# Altium project DC2019_Main_PCB.PrjPCB (part 2 of 2)

## Sheet Row Drivers.SchDoc
size B
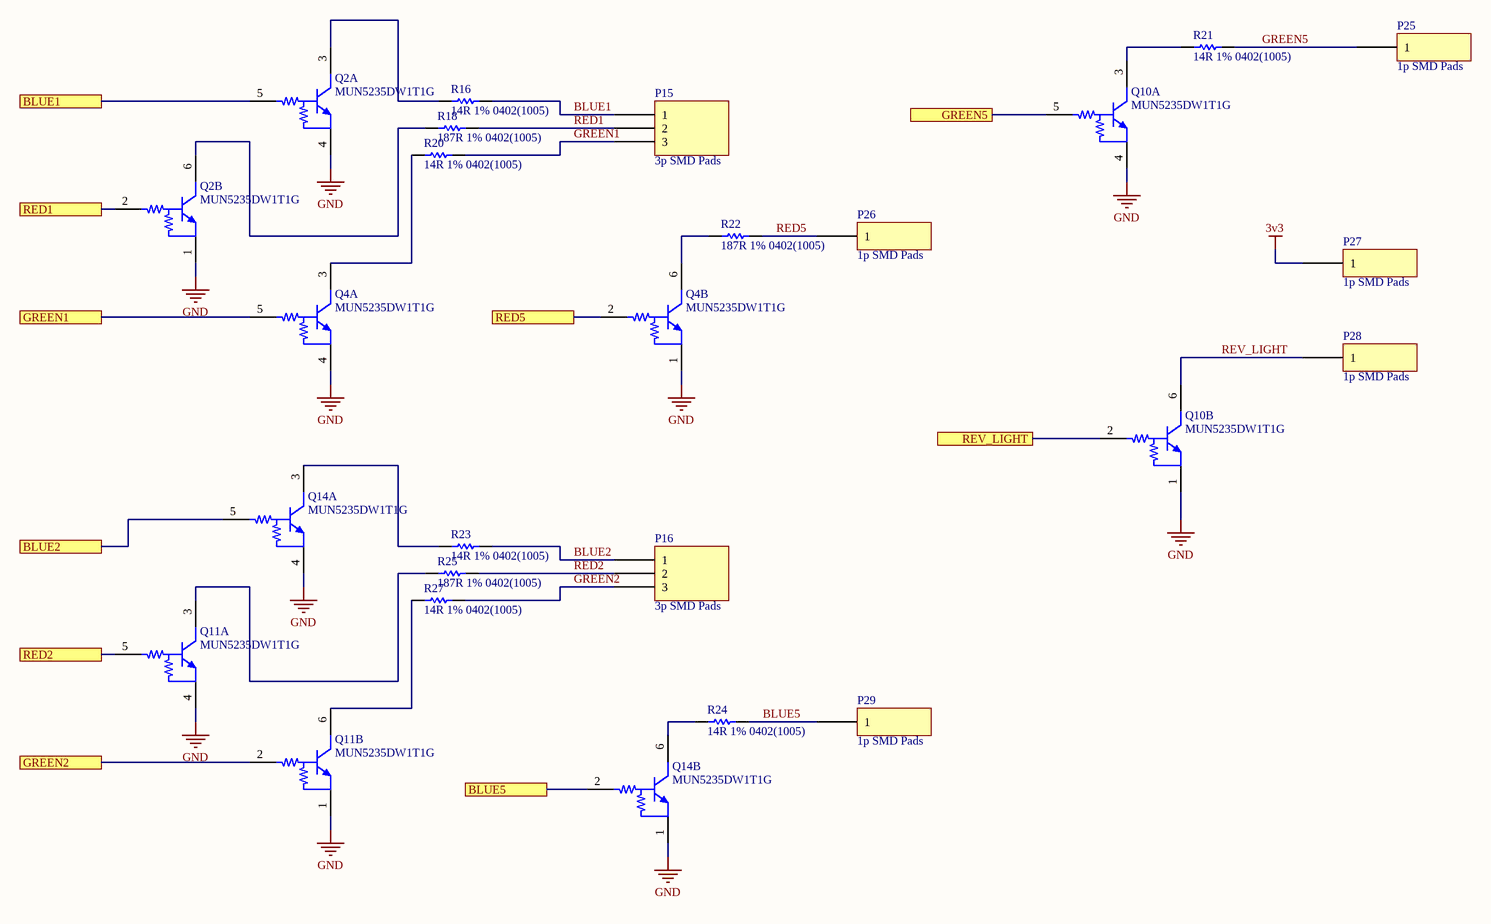
[diagram p17: Row Drivers.SchDoc]

### Parts
P15  3p SMD Pads  [3p SMD pad]
P16  3p SMD Pads  [3p SMD pad]
P25  1p SMD Pads  [1p SMD pad]
P26  1p SMD Pads  [1p SMD pad]
P27  1p SMD Pads  [1p SMD pad]
P28  1p SMD Pads  [1p SMD pad]
P29  1p SMD Pads  [1p SMD pad]
Q2  MUN5235DW1T1G  [ONSC-SOT-363-6-419B-02_V]  (parts A,B of 2)
Q4  MUN5235DW1T1G  [ONSC-SOT-363-6-419B-02_V]  (parts A,B of 2)
Q10  MUN5235DW1T1G  [ONSC-SOT-363-6-419B-02_V]  (parts A,B of 2)
Q11  MUN5235DW1T1G  [ONSC-SOT-363-6-419B-02_V]  (parts A,B of 2)
Q14  MUN5235DW1T1G  [ONSC-SOT-363-6-419B-02_V]  (parts A,B of 2)
R16  14R 1% 0402(1005)  [RESC0402(1005)_N]
R18  187R 1% 0402(1005)  [RESC0402(1005)_N]
R20  14R 1% 0402(1005)  [RESC0402(1005)_N]
R21  14R 1% 0402(1005)  [RESC0402(1005)_N]
R22  187R 1% 0402(1005)  [RESC0402(1005)_N]
R23  14R 1% 0402(1005)  [RESC0402(1005)_N]
R24  14R 1% 0402(1005)  [RESC0402(1005)_N]
R25  187R 1% 0402(1005)  [RESC0402(1005)_N]
R27  14R 1% 0402(1005)  [RESC0402(1005)_N]

### Ports
BLUE1, BLUE2, BLUE5, GREEN1, GREEN2, GREEN5, RED1, RED2, RED5, REV_LIGHT

### Nets
3v3: P27.1
GND: Q2.1(E) Q2.4(E) Q4.1(E) Q4.4(E) Q10.1(E) Q10.4(E) Q11.1(E) Q11.4(E) Q14.1(E) Q14.4(E)
BLUE1: P15.1 R16.2
BLUE2: P16.1 R23.2
BLUE5: P29.1 R24.2
GREEN1: P15.3 R20.2
GREEN2: P16.3 R27.2
GREEN5: P25.1 R21.2
RED1: P15.2 R18.2
RED2: P16.2 R25.2
RED5: P26.1 R22.2
REV_LIGHT: P28.1 Q10.6(C)
NetQ2_2: Q2.2(B) ; port RED1
NetQ2_3: Q2.3(C) R16.1
NetQ2_5: Q2.5(B) ; port BLUE1
NetQ2_6: Q2.6(C) R18.1
NetQ4_2: Q4.2(B) ; port RED5
NetQ4_3: Q4.3(C) R20.1
NetQ4_5: Q4.5(B) ; port GREEN1
NetQ4_6: Q4.6(C) R22.1
NetQ10_2: Q10.2(B) ; port REV_LIGHT
NetQ10_3: Q10.3(C) R21.1
NetQ10_5: Q10.5(B) ; port GREEN5
NetQ11_2: Q11.2(B) ; port GREEN2
NetQ11_3: Q11.3(C) R25.1
NetQ11_5: Q11.5(B) ; port RED2
NetQ11_6: Q11.6(C) R27.1
NetQ14_2: Q14.2(B) ; port BLUE5
NetQ14_3: Q14.3(C) R23.1
NetQ14_5: Q14.5(B) ; port BLUE2
NetQ14_6: Q14.6(C) R24.1

### Notes on the sheet
- Title
- Size:
- Date:
- Letter
- Number:
- Time:
- Revision:
- Sheet
- of
- Copyright 2019
- Specialized Solutions LLC
- 206 W Lincoln Hwy STE B
- New Haven, IN 46774
- www.specsolns.com <http://www.specsolns.com>
- File:

### Library data of the parts
P15 P16 = 3p SMD
P25-P29 = 1p SMD
Q2 Q4 Q10 Q11 Q14 = CMP-0630-00303-1: Dual NPN Bias Resistor Transistors, R1=2.2 kOhm, R2=47 kOhm, NPN Transistors, 6-Pin SOT-363, Pb-Free, Tape and Reel; Manufacturer: On Semiconductor; V(BR)CEO Min (V): 50; hFE Min: 80; IC Continuous (A): 0.1; R1/R2 Typ: 0.047; Packing: Tape and Reel; ComponentLink1URL: http://www.onsemi.com/; Mounting Technology: Surface Mount; ComponentLink1Description: Manufacturer URL; ComponentLink3Description: Package Specification; PackageVersion: Rev. Y, 12/2012; RoHS: TRUE; PackageDescription: 6-Pin Small Outline Transistor, Body 2 x 1.25 mm, Pitch 0.65 mm; PackageReference: SOT-363-6-419B-02; ComponentLink3URL: http://www.onsemi.cn/pub_link/Collateral/419B-02.PDF; DatasheetVersion: Rev. 0; ComponentLink2URL: http://www.onsemi.cn/pub_link/Collateral/DTC123JD-D.PDF; PartNumber: MUN5235DW1T1G; Polarity: Dual NPN; ComponentLink2Description: Datasheet; PartId: 1
R16 R20 R21 R23 R24 R27 = CMP-1011-00299-1: 14R 0.063W 1% 0402 (1005 Metric)  SMD; Value: 14.00 Ohm; Case-EIA: 0402; Case-Metric: 1005; Technology: SMT; Tolerance: 1 %; Power: 0.063 W
R18 R22 R25 = CMP-1011-00426-1: 187R 0.063W 1% 0402 (1005 Metric)  SMD; Case-EIA: 0402; Value: 187.00 Ohm; Case-Metric: 1005; Technology: SMT; Tolerance: 1 %; Power: 0.063 W

## Sheet 6_Axis.SchDoc
size A
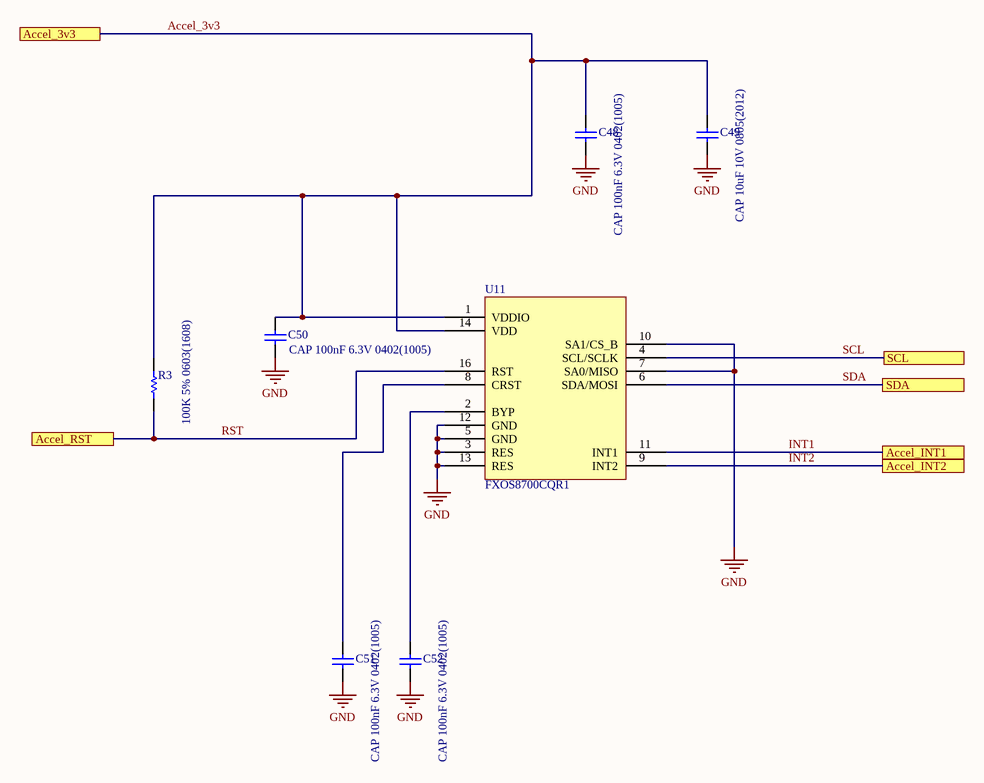
[diagram p18: 6_Axis.SchDoc]

### Parts
C48  CAP 100nF 6.3V 0402(1005)  [CAPC0402(1005)60_M]
C49  CAP 10uF 10V 0805(2012)  [CAPC0805(2012)145_N]
C50  CAP 100nF 6.3V 0402(1005)  [CAPC0402(1005)60_M]
C51  CAP 100nF 6.3V 0402(1005)  [CAPC0402(1005)60_M]
C52  CAP 100nF 6.3V 0402(1005)  [CAPC0402(1005)60_M]
R3  100K 5% 0603(1608)  [RESC0603(1608)_N]
U11  FXOS8700CQR1  [QFN50P300X300X120-16N]

### Ports
Accel_3v3, Accel_INT1, Accel_INT2, Accel_RST, SCL, SDA

### Nets
GND: C48.1 C49.2 C50.1 C51.1 C52.1 U11.3(RES) U11.5(GND) U11.7(SA0/MISO) U11.10(SA1/CS_B) U11.12(GND) U11.13(RES)
Accel_3v3: C48.2 C49.1 C50.2 R3.2 U11.1(VDDIO) U11.14(VDD) ; port Accel_3v3
INT1: U11.11(INT1) ; port Accel_INT1
INT2: U11.9(INT2) ; port Accel_INT2
RST: R3.1 U11.16(RST) ; port Accel_RST
SCL: U11.4(SCL/SCLK) ; port SCL
SDA: U11.6(SDA/MOSI) ; port SDA
NetC51_2: C51.2 U11.8(CRST)
NetC52_2: C52.2 U11.2(BYP)

### Library data of the parts
C48 C50-C52 = CMP-1034-02062-1: CAP 100nF 6.3V ±20% 0402 (1005 Metric) Thickness 0.6mm SMD; Case-EIA: 0402; Tolerance: Â±20%; Case-Metric: 1005; Value: 100nF; Technology: SMT; Max Thickness: 0.6 mm; Rated Voltage: 6.3 V
C49 = CMP-1036-04924-1: CAP 10uF 10V ±20% 0805 (2012 Metric) Thickness 1.45mm SMD; Case-EIA: 0805; Case-Metric: 2012; Tolerance: Â±20%; Rated Voltage: 10 V; Max Thickness: 1.45 mm; Value: 10uF; Technology: SMT
R3 = CMP-1012-00122-1: 100K 0.1W 5% 0603 (1608 Metric)  SMD; Case-EIA: 0603; Value: 100000.00 Ohm; Case-Metric: 1608; Tolerance: 5 %; Power: 0.1 W; Technology: SMT
U11 = FXOS8700CQR1: 6-axis sensor with integrated linear accelerometer and magnetometer

## Nets that join several sheets
3v3: Main (R17.2 R19.2), Gyro (6 pins), SDCard (9 pins), CAN (C42.2 U9.3), Bluetooth (23 pins), 595andMun (9 pins), Main Board RGB (P33.1), MK64 (P4.1 R2.2 TP9.1), MK64 Power ADC (24 pins), Accel (C1.2 C2.2 U3.2), Power (C45.2 U7.5), Row Drivers (P27.1)
GND: Gyro (19 pins), MotorController (9 pins), OLED (13 pins), SDCard (7 pins), CAN (C42.1 U9.2), Bluetooth (22 pins), 595andMun (U1.8), Main Board RGB (10 pins), MK64 (6 pins), MK64 Power ADC (25 pins), Accel (8 pins), Switch and Encoder (SW1.3), Power (C44.1 C45.1 P23.1 U7.2), Row Drivers (10 pins), 6_Axis (11 pins)
VBAT: MotorController (5 pins), OLED (C39.2 U8.6), Power (C44.2 P20.1 U7.1 U7.3)
~{K64_RST}: MK64 (P4.5 R2.1), MK64 Power ADC (U5.74)
Accel_3v3: MK64 (U5.64), 6_Axis (6 pins)
BLUE3: Main Board RGB (R28.2), U_LED Driver/U_Main Board RGB/RGB and TurnS (8 pins)
BLUE4: Main Board RGB (R31.2), U_LED Driver/U_Main Board RGB/RGB and TurnS (8 pins)
Col1: 595andMun (Q6.3), 20p Connector (P1.1 P10.1 P11.1 P12.1), U_LED Driver/U_Main Board RGB/RGB and TurnS (D1_U_LED_Driver_U_Main_Board_RGB_RGB_and_TurnS#1.1), U_LED Driver/U_Main Board RGB/RGB and TurnS (D1_U_LED_Driver_U_Main_Board_RGB_RGB_and_TurnS#2.1)
Col2: 595andMun (Q6.6), 20p Connector (P1.2 P10.2 P11.2 P12.2), U_LED Driver/U_Main Board RGB/RGB and TurnS (D2_U_LED_Driver_U_Main_Board_RGB_RGB_and_TurnS#1.1), U_LED Driver/U_Main Board RGB/RGB and TurnS (D2_U_LED_Driver_U_Main_Board_RGB_RGB_and_TurnS#2.1)
Col3: 595andMun (Q7.3), 20p Connector (P1.3 P10.3 P11.3 P12.3), U_LED Driver/U_Main Board RGB/RGB and TurnS (D3_U_LED_Driver_U_Main_Board_RGB_RGB_and_TurnS#1.1), U_LED Driver/U_Main Board RGB/RGB and TurnS (D3_U_LED_Driver_U_Main_Board_RGB_RGB_and_TurnS#2.1)
Col4: 595andMun (Q7.6), 20p Connector (P1.4 P10.4 P11.4 P12.4), U_LED Driver/U_Main Board RGB/RGB and TurnS (D4_U_LED_Driver_U_Main_Board_RGB_RGB_and_TurnS#1.1), U_LED Driver/U_Main Board RGB/RGB and TurnS (D4_U_LED_Driver_U_Main_Board_RGB_RGB_and_TurnS#2.1)
Col5: 595andMun (Q9.3), 20p Connector (P1.5 P10.5 P11.5 P12.5), U_LED Driver/U_Main Board RGB/RGB and TurnS (D5_U_LED_Driver_U_Main_Board_RGB_RGB_and_TurnS#1.1), U_LED Driver/U_Main Board RGB/RGB and TurnS (D5_U_LED_Driver_U_Main_Board_RGB_RGB_and_TurnS#2.1)
Col6: 595andMun (Q9.6), 20p Connector (P1.6 P10.6 P11.6 P12.6), U_LED Driver/U_Main Board RGB/RGB and TurnS (D6_U_LED_Driver_U_Main_Board_RGB_RGB_and_TurnS#1.1), U_LED Driver/U_Main Board RGB/RGB and TurnS (D6_U_LED_Driver_U_Main_Board_RGB_RGB_and_TurnS#2.1)
Col7: 595andMun (Q8.3), 20p Connector (P1.7 P10.7 P11.7 P12.7), U_LED Driver/U_Main Board RGB/RGB and TurnS (D7_U_LED_Driver_U_Main_Board_RGB_RGB_and_TurnS#1.1), U_LED Driver/U_Main Board RGB/RGB and TurnS (D7_U_LED_Driver_U_Main_Board_RGB_RGB_and_TurnS#2.1)
Col8: 595andMun (Q8.6), 20p Connector (P1.8 P10.8 P11.8 P12.8), U_LED Driver/U_Main Board RGB/RGB and TurnS (D13_U_LED_Driver_U_Main_Board_RGB_RGB_and_TurnS#1.1), U_LED Driver/U_Main Board RGB/RGB and TurnS (D13_U_LED_Driver_U_Main_Board_RGB_RGB_and_TurnS#2.1)
GREEN3: Main Board RGB (R30.2), U_LED Driver/U_Main Board RGB/RGB and TurnS (8 pins)
GREEN4: Main Board RGB (R33.2), U_LED Driver/U_Main Board RGB/RGB and TurnS (8 pins)
INT1: MK64 (U5.68), 6_Axis (U11.11)
INT2: MK64 (U5.69), 6_Axis (U11.9)
NetC3_2: MK64 (U5.104), Accel (C3.2 U3.9)
NetC4_2: MK64 (U5.103), Accel (C4.2 U3.10)
NetC5_2: MK64 (U5.105), Accel (C5.2 U3.8)
NetP7_1: SDCard (P7.1 R7.1), MK64 (U5.8)
NetP7_2: SDCard (P7.2 R10.1), MK64 (U5.7)
NetP7_3: SDCard (P7.3 R8.1), MK64 (U5.4)
NetP7_7: SDCard (P7.7 R11.1), MK64 (U5.2)
NetP7_8: SDCard (P7.8 R9.1), MK64 (U5.1)
NetP7_9: SDCard (P7.9 R12.1), MK64 (U5.144)
NetQ2_2: MK64 (U5.128), Row Drivers (Q2.2)
NetQ2_5: MK64 (U5.127), Row Drivers (Q2.5)
NetQ3_2: Main Board RGB (Q3.2), MK64 (U5.139)
NetQ3_5: Main Board RGB (Q3.5), MK64 (U5.138)
NetQ4_2: MK64 (U5.142), Row Drivers (Q4.2)
NetQ4_5: MK64 (U5.129), Row Drivers (Q4.5)
NetQ5_2: Main Board RGB (Q5.2), MK64 (U5.47)
NetQ5_5: Main Board RGB (Q5.5), MK64 (U5.140)
NetQ10_2: MK64 (U5.92), Row Drivers (Q10.2)
NetQ10_5: MK64 (U5.143), Row Drivers (Q10.5)
NetQ11_2: MK64 (U5.132), Row Drivers (Q11.2)
NetQ11_5: MK64 (U5.131), Row Drivers (Q11.5)
NetQ12_2: Main Board RGB (Q12.2), MK64 (U5.136)
NetQ12_5: Main Board RGB (Q12.5), MK64 (U5.133)
NetQ13_2: Main Board RGB (Q13.2), MK64 (U5.10)
NetQ13_5: Main Board RGB (Q13.5), MK64 (U5.137)
NetQ14_2: MK64 (U5.141), Row Drivers (Q14.2)
NetQ14_5: MK64 (U5.130), Row Drivers (Q14.5)
NetR13_1: SDCard (R13.1), MK64 (U5.3)
NetSW1_1: MK64 (U5.63), Switch and Encoder (SW1.1)
NetSW1_2: MK64 (U5.62), Switch and Encoder (SW1.2)
NetU1_10: 595andMun (U1.10), MK64 (U5.79)
NetU1_11: 595andMun (U1.11), MK64 (U5.78)
NetU1_12: 595andMun (U1.12), MK64 (U5.77)
NetU1_13: 595andMun (U1.13), MK64 (U5.76)
NetU1_14: 595andMun (U1.14), MK64 (U5.75)
NetU2_1: MotorController (U2.1), MK64 (U5.58)
NetU2_2: MotorController (U2.2), MK64 (U5.59)
NetU2_12: MotorController (U2.12), MK64 (U5.114)
NetU2_13: MotorController (U2.13), MK64 (U5.60)
NetU3_3: MK64 (U5.100), Accel (U3.3)
NetU3_4: MK64 (U5.101), Accel (U3.4)
NetU3_5: MK64 (U5.102), Accel (U3.5)
NetU4_46: Bluetooth (U4.46), MK64 (U5.66)
NetU4_47: Bluetooth (U4.47), MK64 (U5.67)
NetU5_85: Gyro (U6.4), MK64 (U5.85)
NetU5_86: Gyro (U6.3), MK64 (U5.86)
NetU5_87: Gyro (U6.2), MK64 (U5.87)
NetU5_89: OLED (U8.14), MK64 (U5.89)
NetU5_97: CAN (U9.1), MK64 (U5.97)
NetU5_98: CAN (U9.4), MK64 (U5.98)
NetU5_99: CAN (U9.8), MK64 (U5.99)
OLED_3V3: OLED (C40.2 U8.9 U8.11), MK64 (U5.90)
RED3: Main Board RGB (R29.2), U_LED Driver/U_Main Board RGB/RGB and TurnS (8 pins)
RED4: Main Board RGB (R32.2), U_LED Driver/U_Main Board RGB/RGB and TurnS (8 pins)
RST: MK64 (U5.65), 6_Axis (R3.1 U11.16)
SCL: Main (R17.1), Gyro (U6.11), OLED (U8.18), MK64 (U5.115), 6_Axis (U11.4)
SDA: Main (R19.1), Gyro (U6.12), OLED (U8.19 U8.20), MK64 (U5.116), 6_Axis (U11.6)
SW1: MK64 (U5.80), Switch and Encoder (P8.1)
UI_ENC_SIGA: MK64 (U5.81), Switch and Encoder (P18.1)
UI_ENC_SIGB: MK64 (U5.82), Switch and Encoder (P19.1)